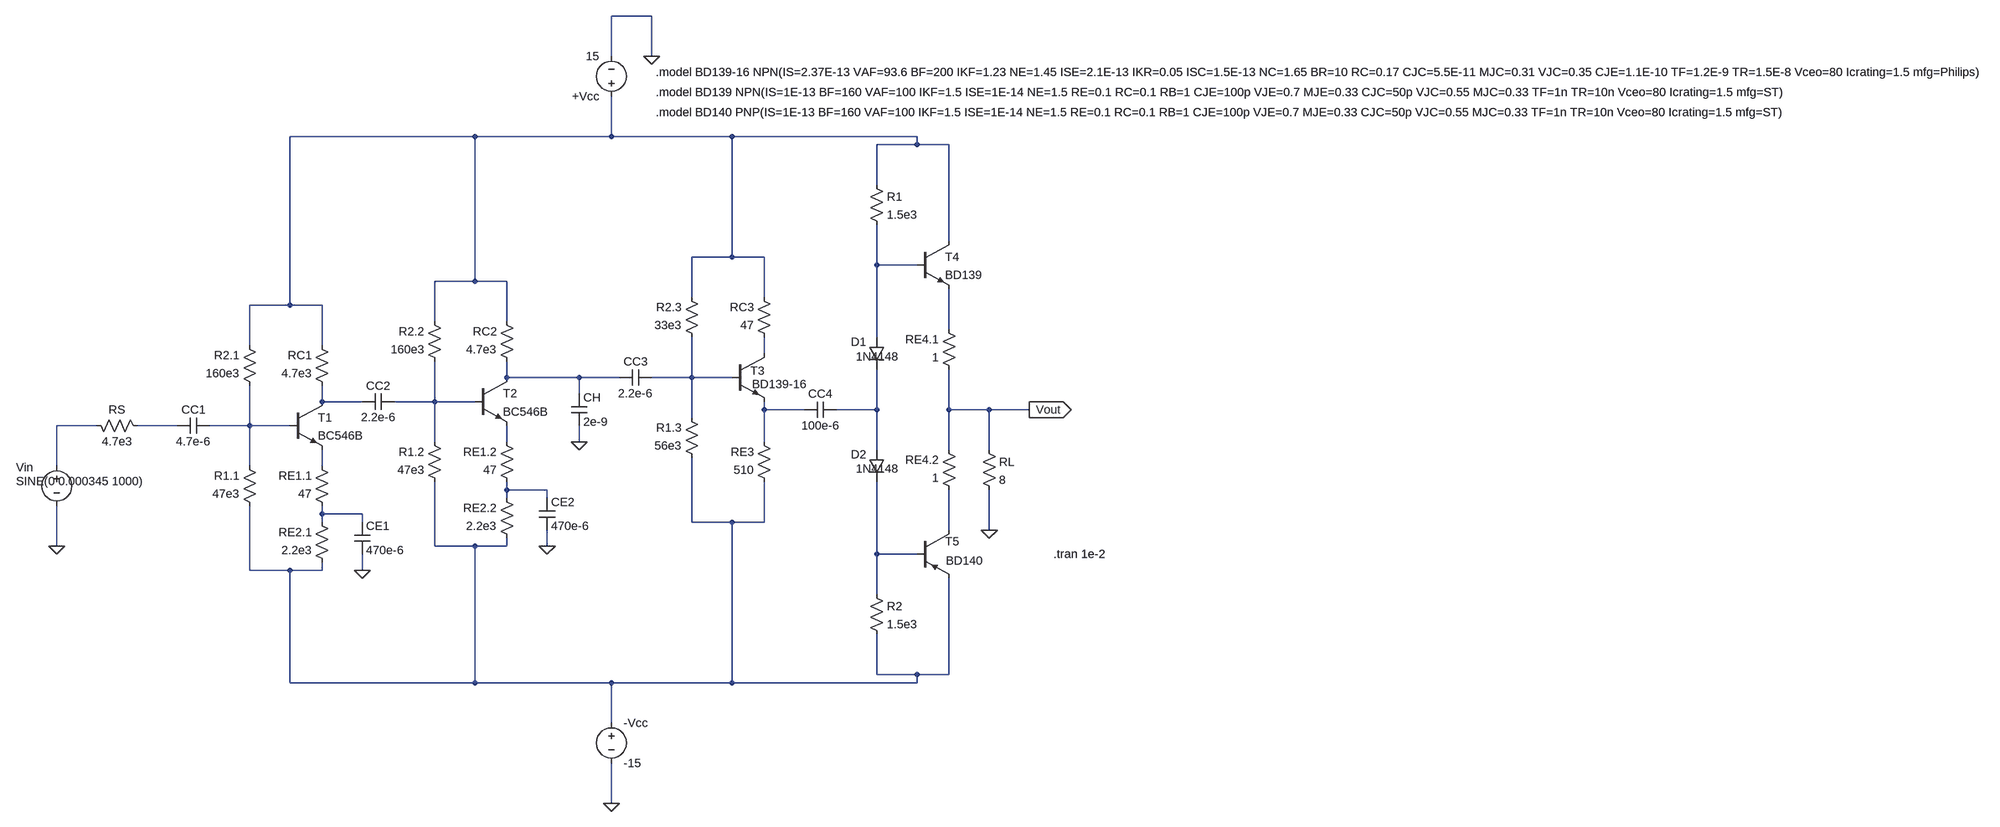
[diagram p0: schematic faz3_kaskat.asc]
faz3_kaskat.asc, the LTspice schematic file:
Version 4
SHEET 1 1896 1972
WIRE -2032 -1072 -2112 -1072
WIRE -2112 -992 -2112 -1072
WIRE -2032 -992 -2032 -1072
WIRE -2384 -832 -2752 -832
WIRE -2112 -832 -2112 -912
WIRE -2112 -832 -2384 -832
WIRE -1872 -832 -2112 -832
WIRE -1504 -832 -1872 -832
WIRE -1504 -816 -1504 -832
WIRE -1504 -816 -1584 -816
WIRE -1440 -816 -1504 -816
WIRE -1584 -736 -1584 -816
WIRE -1440 -624 -1440 -816
WIRE -1872 -592 -1872 -832
WIRE -1872 -592 -1952 -592
WIRE -1808 -592 -1872 -592
WIRE -1584 -576 -1584 -656
WIRE -1504 -576 -1584 -576
WIRE -2384 -544 -2384 -832
WIRE -2384 -544 -2464 -544
WIRE -2320 -544 -2384 -544
WIRE -1952 -512 -1952 -592
WIRE -1808 -512 -1808 -592
WIRE -2752 -496 -2752 -832
WIRE -2752 -496 -2832 -496
WIRE -2688 -496 -2752 -496
WIRE -2464 -464 -2464 -544
WIRE -2320 -464 -2320 -544
WIRE -1440 -448 -1440 -528
WIRE -1584 -432 -1584 -576
WIRE -2832 -416 -2832 -496
WIRE -2688 -416 -2688 -496
WIRE -1808 -400 -1808 -432
WIRE -2320 -352 -2320 -384
WIRE -2176 -352 -2320 -352
WIRE -2096 -352 -2176 -352
WIRE -1952 -352 -1952 -432
WIRE -1952 -352 -2032 -352
WIRE -1872 -352 -1952 -352
WIRE -2176 -320 -2176 -352
WIRE -2688 -304 -2688 -336
WIRE -2608 -304 -2688 -304
WIRE -2464 -304 -2464 -384
WIRE -2464 -304 -2544 -304
WIRE -2384 -304 -2464 -304
WIRE -1808 -288 -1808 -304
WIRE -1728 -288 -1808 -288
WIRE -1584 -288 -1584 -368
WIRE -1584 -288 -1664 -288
WIRE -1440 -288 -1440 -368
WIRE -1360 -288 -1440 -288
WIRE -1280 -288 -1360 -288
WIRE -1952 -272 -1952 -352
WIRE -3136 -256 -3216 -256
WIRE -2976 -256 -3056 -256
WIRE -2832 -256 -2832 -336
WIRE -2832 -256 -2912 -256
WIRE -2752 -256 -2832 -256
WIRE -2464 -224 -2464 -304
WIRE -2320 -224 -2320 -256
WIRE -2176 -224 -2176 -256
WIRE -1808 -224 -1808 -288
WIRE -1584 -208 -1584 -288
WIRE -1440 -208 -1440 -288
WIRE -1360 -208 -1360 -288
WIRE -3216 -176 -3216 -256
WIRE -2832 -176 -2832 -256
WIRE -2688 -176 -2688 -208
WIRE -2320 -128 -2320 -144
WIRE -2240 -128 -2320 -128
WIRE -2320 -112 -2320 -128
WIRE -2240 -112 -2240 -128
WIRE -2688 -80 -2688 -96
WIRE -2608 -80 -2688 -80
WIRE -2688 -64 -2688 -80
WIRE -2608 -64 -2608 -80
WIRE -1952 -64 -1952 -192
WIRE -1872 -64 -1952 -64
WIRE -1808 -64 -1808 -144
WIRE -1808 -64 -1872 -64
WIRE -1440 -48 -1440 -128
WIRE -1360 -48 -1360 -128
WIRE -3216 -16 -3216 -96
WIRE -2464 -16 -2464 -144
WIRE -2384 -16 -2464 -16
WIRE -2320 -16 -2320 -32
WIRE -2320 -16 -2384 -16
WIRE -2240 -16 -2240 -48
WIRE -1584 0 -1584 -144
WIRE -1504 0 -1584 0
WIRE -2832 32 -2832 -96
WIRE -2752 32 -2832 32
WIRE -2688 32 -2688 16
WIRE -2688 32 -2752 32
WIRE -2608 32 -2608 0
WIRE -1584 80 -1584 0
WIRE -1584 240 -1584 160
WIRE -1504 240 -1584 240
WIRE -1440 240 -1440 48
WIRE -1440 240 -1504 240
WIRE -2752 256 -2752 32
WIRE -2384 256 -2384 -16
WIRE -2384 256 -2752 256
WIRE -2112 256 -2384 256
WIRE -1872 256 -1872 -64
WIRE -1872 256 -2112 256
WIRE -1504 256 -1504 240
WIRE -1504 256 -1872 256
WIRE -2112 336 -2112 256
WIRE -2112 496 -2112 416
FLAG -2608 32 0
FLAG -3216 -16 0
FLAG -2240 -16 0
FLAG -2112 496 0
FLAG -2032 -992 0
FLAG -2176 -224 0
FLAG -1280 -288 Vout
IOPIN -1280 -288 Out
FLAG -1360 -48 0
SYMBOL cap -2032 -368 R90
WINDOW 0 0 32 VBottom 2
WINDOW 3 32 32 VTop 2
SYMATTR InstName CC3
SYMATTR Value 2.2e-6
SYMBOL res -1936 -416 R180
WINDOW 0 36 76 Left 2
WINDOW 3 36 40 Left 2
SYMATTR InstName R2.3
SYMATTR Value 33e3
SYMBOL res -1936 -176 R180
WINDOW 0 36 76 Left 2
WINDOW 3 36 40 Left 2
SYMATTR InstName R1.3
SYMATTR Value 56e3
SYMBOL npn -1872 -400 R0
WINDOW 0 37 35 Left 2
WINDOW 3 40 61 Left 2
SYMATTR InstName T3
SYMATTR Value BD139-16
SYMBOL res -1792 -416 R180
WINDOW 0 36 76 Left 2
WINDOW 3 36 40 Left 2
SYMATTR InstName RC3
SYMATTR Value 47
SYMBOL res -1792 -128 R180
WINDOW 0 36 76 Left 2
WINDOW 3 36 40 Left 2
SYMATTR InstName RE3
SYMATTR Value 510
SYMBOL res -3152 -272 M90
WINDOW 0 0 56 VBottom 2
WINDOW 3 32 56 VTop 2
SYMATTR InstName RS
SYMATTR Value 4.7e3
SYMBOL cap -1664 -304 R90
WINDOW 0 0 32 VBottom 2
WINDOW 3 32 32 VTop 2
SYMATTR InstName CC4
SYMATTR Value 100e-6
SYMBOL npn -2752 -304 R0
SYMATTR InstName T1
SYMATTR Value BC546B
SYMBOL res -2816 -320 R180
WINDOW 0 36 76 Left 2
WINDOW 3 36 40 Left 2
SYMATTR InstName R2.1
SYMATTR Value 160e3
SYMBOL res -2672 -320 R180
WINDOW 0 36 76 Left 2
WINDOW 3 36 40 Left 2
SYMATTR InstName RC1
SYMATTR Value 4.7e3
SYMBOL res -2816 -80 R180
WINDOW 0 36 76 Left 2
WINDOW 3 36 40 Left 2
SYMATTR InstName R1.1
SYMATTR Value 47e3
SYMBOL res -2672 -80 R180
WINDOW 0 36 76 Left 2
WINDOW 3 36 40 Left 2
SYMATTR InstName RE1.1
SYMATTR Value 47
SYMBOL res -2672 32 R180
WINDOW 0 36 76 Left 2
WINDOW 3 36 40 Left 2
SYMATTR InstName RE2.1
SYMATTR Value 2.2e3
SYMBOL cap -2624 -64 R0
SYMATTR InstName CE1
SYMATTR Value 470e-6
SYMBOL cap -2912 -272 R90
WINDOW 0 0 32 VBottom 2
WINDOW 3 32 32 VTop 2
SYMATTR InstName CC1
SYMATTR Value 4.7e-6
SYMBOL voltage -3216 -192 R0
WINDOW 123 -81 47 Left 2
WINDOW 39 0 0 Left 0
WINDOW 0 -81 19 Left 2
WINDOW 3 -81 47 Left 2
SYMATTR InstName Vin
SYMATTR Value SINE(0 0.000345 1000)
SYMBOL cap -2192 -320 R0
SYMATTR InstName CH
SYMATTR Value 2e-9
SYMBOL npn -2384 -352 R0
SYMATTR InstName T2
SYMATTR Value BC546B
SYMBOL res -2448 -368 R180
WINDOW 0 36 76 Left 2
WINDOW 3 36 40 Left 2
SYMATTR InstName R2.2
SYMATTR Value 160e3
SYMBOL res -2304 -368 R180
WINDOW 0 36 76 Left 2
WINDOW 3 36 40 Left 2
SYMATTR InstName RC2
SYMATTR Value 4.7e3
SYMBOL res -2448 -128 R180
WINDOW 0 36 76 Left 2
WINDOW 3 36 40 Left 2
SYMATTR InstName R1.2
SYMATTR Value 47e3
SYMBOL res -2304 -128 R180
WINDOW 0 36 76 Left 2
WINDOW 3 36 40 Left 2
SYMATTR InstName RE1.2
SYMATTR Value 47
SYMBOL res -2304 -16 R180
WINDOW 0 36 76 Left 2
WINDOW 3 36 40 Left 2
SYMATTR InstName RE2.2
SYMATTR Value 2.2e3
SYMBOL cap -2256 -112 R0
SYMATTR InstName CE2
SYMATTR Value 470e-6
SYMBOL cap -2544 -320 R90
WINDOW 0 0 32 VBottom 2
WINDOW 3 32 32 VTop 2
SYMATTR InstName CC2
SYMATTR Value 2.2e-6
SYMBOL voltage -2112 320 R0
WINDOW 123 0 0 Left 0
WINDOW 39 0 0 Left 0
SYMATTR InstName -Vcc
SYMATTR Value -15
SYMBOL voltage -2112 -896 R180
WINDOW 123 0 0 Left 0
WINDOW 39 0 0 Left 0
SYMATTR InstName +Vcc
SYMATTR Value 15
SYMBOL npn -1504 -624 R0
SYMATTR InstName T4
SYMATTR Value BD139
SYMBOL res -1424 -352 R180
WINDOW 0 36 76 Left 2
WINDOW 3 36 40 Left 2
SYMATTR InstName RE4.1
SYMATTR Value 1
SYMBOL res -1424 -112 R180
WINDOW 0 36 76 Left 2
WINDOW 3 36 40 Left 2
SYMATTR InstName RE4.2
SYMATTR Value 1
SYMBOL pnp -1504 -48 R0
WINDOW 0 56 23 Left 2
WINDOW 3 58 61 Left 2
SYMATTR InstName T5
SYMATTR Value BD140
SYMBOL res -1376 -224 R0
SYMATTR InstName RL
SYMATTR Value 8
SYMBOL res -1600 -752 R0
SYMATTR InstName R1
SYMATTR Value 1.5e3
SYMBOL res -1600 64 R0
SYMATTR InstName R2
SYMATTR Value 1.5e3
SYMBOL diode -1600 -432 R0
WINDOW 0 -35 9 Left 2
WINDOW 3 -25 38 Left 2
SYMATTR InstName D1
SYMATTR Value 1N4148
SYMBOL diode -1600 -208 R0
WINDOW 0 -35 9 Left 2
WINDOW 3 -25 38 Left 2
SYMATTR InstName D2
SYMATTR Value 1N4148
TEXT -2024 -960 Left 2 !.model BD139-16 NPN(IS=2.37E-13 VAF=93.6 BF=200 IKF=1.23 NE=1.45 ISE=2.1E-13 IKR=0.05 ISC=1.5E-13 NC=1.65 BR=10 RC=0.17 CJC=5.5E-11 MJC=0.31 VJC=0.35 CJE=1.1E-10 TF=1.2E-9 TR=1.5E-8 Vceo=80 Icrating=1.5 mfg=Philips)
TEXT -2024 -920 Left 2 !.model BD139 NPN(IS=1E-13 BF=160 VAF=100 IKF=1.5 ISE=1E-14 NE=1.5 RE=0.1 RC=0.1 RB=1 CJE=100p VJE=0.7 MJE=0.33 CJC=50p VJC=0.55 MJC=0.33 TF=1n TR=10n Vceo=80 Icrating=1.5 mfg=ST)
TEXT -2024 -880 Left 2 !.model BD140 PNP(IS=1E-13 BF=160 VAF=100 IKF=1.5 ISE=1E-14 NE=1.5 RE=0.1 RC=0.1 RB=1 CJE=100p VJE=0.7 MJE=0.33 CJC=50p VJC=0.55 MJC=0.33 TF=1n TR=10n Vceo=80 Icrating=1.5 mfg=ST)
TEXT -1232 0 Left 2 !.tran 1e-2

The netlist it stands for:
* faz3_kaskat.asc
CC3 N006 N005 2.2e-6
R2.3 N006 N001 33e3
R1.3 N018 N006 56e3
Q§T3 N004 N006 N009 0 BD139-16
RC3 N004 N001 47
RE3 N018 N009 510
RS N011 N012 4.7e3
CC4 N010 N009 100e-6
Q§T1 N007 N013 N015 0 BC546B
R2.1 N013 N001 160e3
RC1 N007 N001 4.7e3
R1.1 N018 N013 47e3
RE1.1 N017 N015 47
RE2.1 N018 N017 2.2e3
CE1 N017 0 470e-6
CC1 N013 N012 4.7e-6
Vin N011 0 SINE(0 0.000345 1000)
CH N005 0 2e-9
Q§T2 N005 N008 N014 0 BC546B
R2.2 N008 N001 160e3
RC2 N005 N001 4.7e3
R1.2 N018 N008 47e3
RE1.2 N016 N014 47
RE2.2 N018 N016 2.2e3
CE2 N016 0 470e-6
CC2 N008 N007 2.2e-6
V§-Vcc N018 0 -15
V§+Vcc N001 0 15
Q§T4 N001 N002 N003 0 BD139
RE4.1 Vout N003 1
RE4.2 N019 Vout 1
Q§T5 N019 N020 N018 0 BD140
RL Vout 0 8
R1 N001 N002 1.5e3
R2 N020 N018 1.5e3
D1 N002 N010 1N4148
D2 N010 N020 1N4148
.model D D
.lib standard.dio
.model NPN NPN
.model PNP PNP
.lib standard.bjt
.model BD139-16 NPN(IS=2.37E-13 VAF=93.6 BF=200 IKF=1.23 NE=1.45 ISE=2.1E-13 IKR=0.05 ISC=1.5E-13 NC=1.65 BR=10 RC=0.17 CJC=5.5E-11 MJC=0.31 VJC=0.35 CJE=1.1E-10 TF=1.2E-9 TR=1.5E-8 Vceo=80 Icrating=1.5 mfg=Philips)
.model BD139 NPN(IS=1E-13 BF=160 VAF=100 IKF=1.5 ISE=1E-14 NE=1.5 RE=0.1 RC=0.1 RB=1 CJE=100p VJE=0.7 MJE=0.33 CJC=50p VJC=0.55 MJC=0.33 TF=1n TR=10n Vceo=80 Icrating=1.5 mfg=ST)
.model BD140 PNP(IS=1E-13 BF=160 VAF=100 IKF=1.5 ISE=1E-14 NE=1.5 RE=0.1 RC=0.1 RB=1 CJE=100p VJE=0.7 MJE=0.33 CJC=50p VJC=0.55 MJC=0.33 TF=1n TR=10n Vceo=80 Icrating=1.5 mfg=ST)
.tran 1e-2
.backanno
.end